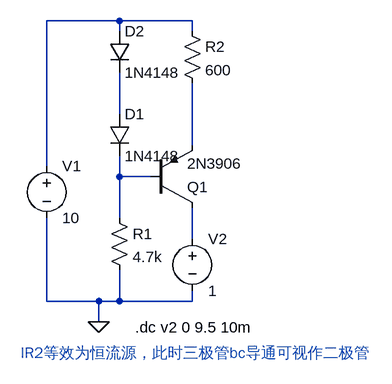
[diagram p0: schematic Draft2.asc]
Draft2.asc, the LTspice schematic file:
Version 4
SHEET 1 880 680
WIRE 288 32 176 32
WIRE 400 32 288 32
WIRE 288 48 288 32
WIRE 400 48 400 32
WIRE 288 176 288 112
WIRE 400 224 400 128
WIRE 176 256 176 32
WIRE 288 272 288 240
WIRE 336 272 288 272
WIRE 288 336 288 272
WIRE 400 368 400 320
WIRE 176 464 176 336
WIRE 256 464 176 464
WIRE 288 464 288 416
WIRE 288 464 256 464
WIRE 400 464 400 448
WIRE 400 464 288 464
WIRE 256 496 256 464
FLAG 256 496 0
SYMBOL Voltage 176 240 R0
SYMATTR InstName V1
SYMATTR Value 10
SYMBOL diode 272 176 R0
SYMATTR InstName D1
SYMATTR Value 1N4148
SYMBOL diode 272 48 R0
SYMATTR InstName D2
SYMATTR Value 1N4148
SYMBOL Res 272 320 R0
SYMATTR InstName R1
SYMATTR Value 4.7k
SYMBOL Res 384 32 R0
SYMATTR InstName R2
SYMATTR Value 600
SYMBOL pnp 336 320 M180
SYMATTR InstName Q1
SYMATTR Value 2N3906
SYMBOL Voltage 400 352 R0
SYMATTR InstName V2
SYMATTR Value 1
TEXT 312 504 Left 2 !.dc v2 0 9.5 10m
TEXT 136 544 Left 2 ;IR2等效为恒流源，此时三极管bc导通可视作二极管

The netlist it stands for:
* Draft2.asc
V1 N001 0 10
D1 N002 N004 1N4148
D2 N001 N002 1N4148
R1 N004 0 4.7k
R2 N001 N003 600
Q1 N005 N004 N003 0 2N3906
V2 N005 0 1
.model D D
.lib standard.dio
.model NPN NPN
.model PNP PNP
.lib standard.bjt
.dc v2 0 9.5 10m
* IR2等效为恒流源，此时三极管bc导通可视作二极管
.backanno
.end